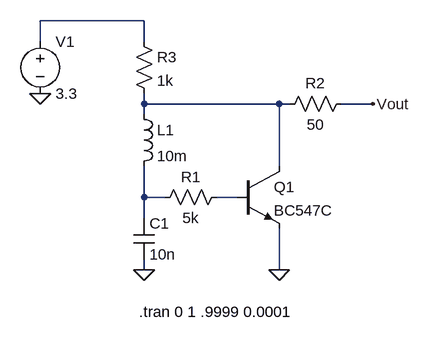
[diagram p0: schematic 06B-09.asc]
06B-09.asc, the LTspice schematic file:
Version 4.1
SHEET 1 880 680
WIRE 64 -64 -96 -64
WIRE -96 -32 -96 -64
WIRE 64 -32 64 -64
WIRE 64 64 64 48
WIRE 272 64 64 64
WIRE 288 64 272 64
WIRE 416 64 368 64
WIRE 64 80 64 64
WIRE 272 160 272 64
WIRE 64 208 64 160
WIRE 96 208 64 208
WIRE 208 208 176 208
WIRE 64 240 64 208
WIRE 64 320 64 304
WIRE 272 320 272 256
FLAG 64 320 0
FLAG 272 320 0
FLAG -96 48 0
FLAG 416 64 Vout
SYMBOL npn 208 160 R0
SYMATTR InstName Q1
SYMATTR Value BC547C
SYMBOL res 192 192 R90
WINDOW 0 0 56 VBottom 2
WINDOW 3 32 56 VTop 2
SYMATTR InstName R1
SYMATTR Value 5k
SYMBOL res 384 48 R90
WINDOW 0 0 56 VBottom 2
WINDOW 3 32 56 VTop 2
SYMATTR InstName R2
SYMATTR Value 50
SYMBOL ind 48 64 R0
SYMATTR InstName L1
SYMATTR Value 10m
SYMBOL cap 48 240 R0
SYMATTR InstName C1
SYMATTR Value 10n
SYMBOL res 48 -48 R0
SYMATTR InstName R3
SYMATTR Value 1k
SYMBOL voltage -96 -48 R0
WINDOW 123 0 0 Left 0
WINDOW 39 0 0 Left 0
SYMATTR InstName V1
SYMATTR Value 3.3
TEXT 56 384 Left 2 !.tran 0 1 .9999 0.0001

The netlist it stands for:
* 06B-09.asc
Q1 N002 N004 0 0 BC547C
R1 N004 N003 5k
R2 Vout N002 50
L1 N002 N003 10m
C1 N003 0 10n
R3 N001 N002 1k
V1 N001 0 3.3
.model NPN NPN
.model PNP PNP
.lib standard.bjt
.tran 0 1 .9999 0.0001
.backanno
.end